# EAGLE design schemat (EAGLE 5.12)
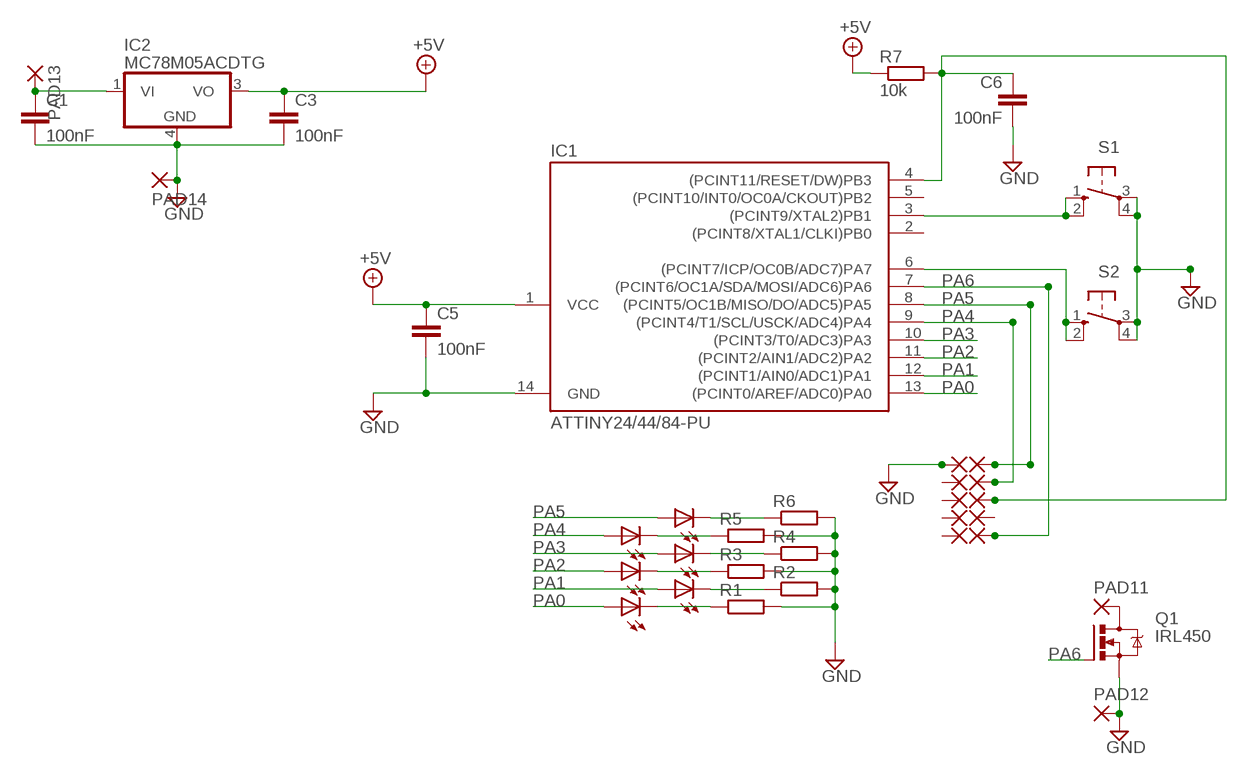
[diagram p0: schematic, sheet 1]

## Parts
C1  100nF  C-EU025-024X044  [C025-024X044]
C3  100nF  C-EU025-024X044  [C025-024X044]
C5  100nF  C-EU075-032X103  [C075-032X103]
C6  100nF  C-EU025-024X044  [C025-024X044]
IC1  ATTINY24/44/84-PU  [DIL14]
IC2  MC78M05ACDTG  [DPACK_3]
LED1  TLLG4400  [LED3MM]
LED2  TLLG4400  [LED3MM]
LED3  TLLY4400  [LED3MM]
LED4  TLLY4400  [LED3MM]
LED5  TLLR4400  [LED3MM]
LED6  TLLR4400  [LED3MM]
PAD1  1,6/0,8  [1,6/0,8]
PAD2  1,6/0,8  [1,6/0,8]
PAD3  1,6/0,8  [1,6/0,8]
PAD4  1,6/0,8  [1,6/0,8]
PAD5  1,6/0,8  [1,6/0,8]
PAD6  1,6/0,8  [1,6/0,8]
PAD7  1,6/0,8  [1,6/0,8]
PAD8  1,6/0,8  [1,6/0,8]
PAD9  1,6/0,8  [1,6/0,8]
PAD10  1,6/0,8  [1,6/0,8]
PAD11  3,81/1,4  [3,81/1,4]
PAD12  3,81/1,4  [3,81/1,4]
PAD13  2,15/1,0  [2,15/1,0]
PAD14  2,15/1,0  [2,15/1,0]
Q1  IRL450  IRLZ44Z  [TO220BH]
R1  R-EU_0204/7  [0204/7]
R2  R-EU_0204/7  [0204/7]
R3  R-EU_0204/7  [0204/7]
R4  R-EU_0204/7  [0204/7]
R5  R-EU_0204/7  [0204/7]
R6  R-EU_0204/7  [0204/7]
R7  10k  R-EU_0204/7  [0204/7]
S1  10-XX  [B3F-10XX]
S2  10-XX  [B3F-10XX]

## Nets
+5V: C3.1 C5.1 IC1.1(VCC) IC2.3(VO) R7.1
GND: C1.2 C3.2 C5.2 C6.2 IC1.14(GND) IC2.4(GND) PAD10.1(P) PAD12.1(P) PAD14.1(P) Q1.S R1.2 R2.2 R3.2 R4.2 R5.2 R6.2 S1.3(P) S1.4(P1) S2.3(P) S2.4(P1)
N$1: IC1.3((PCINT9/XTAL2)PB1) S1.1(S) S1.2(S1)
N$2: C1.1 IC2.1(VI) PAD13.1(P)
N$4: C6.1 IC1.4((PCINT11/RESET/DW)PB3) PAD3.1(P) R7.2
N$6: LED2.K(C) R2.1
N$7: LED1.K(C) R1.1
N$8: LED3.K(C) R3.1
N$9: LED4.K(C) R4.1
N$10: LED5.K(C) R5.1
N$11: LED6.K(C) R6.1
N$12: PAD11.1(P) Q1.D
N$17: IC1.6((PCINT7/ICP/OC0B/ADC7)PA7) S2.1(S) S2.2(S1)
PA0: IC1.13((PCINT0/AREF/ADC0)PA0) LED1.A
PA1: IC1.12((PCINT1/AIN0/ADC1)PA1) LED2.A
PA2: IC1.11((PCINT2/AIN1/ADC2)PA2) LED3.A
PA3: IC1.10((PCINT3/T0/ADC3)PA3) LED4.A
PA4: IC1.9((PCINT4/T1/SCL/USCK/ADC4)PA4) LED5.A PAD2.1(P)
PA5: IC1.8((PCINT5/OC1B/MISO/DO/ADC5)PA5) LED6.A PAD1.1(P)
PA6: IC1.7((PCINT6/OC1A/SDA/MOSI/ADC6)PA6) PAD5.1(P) Q1.G
Unconnected: IC1.2((PCINT8/XTAL1/CLKI)PB0) IC1.5((PCINT10/INT0/OC0A/CKOUT)PB2) PAD4.1(P) PAD6.1(P) PAD7.1(P) PAD8.1(P) PAD9.1(P)

## Library data of the parts
C1 C3 C5 C6 = rcl:C-EU: CAPACITOR, European symbol
IC1 = attiny24_44_84:ATTINY24/44/84
IC2 = linear:MC78M: 500 mA Positive Voltage Regulators Source: Data sheet <http://www.onsemi.com/pub_link/Collateral/MC78M00-D.PDF>
LED1 LED2 = led:TLLG4400: Low Current (2mA) LED 3 mm Tinted Diffused Package color GREEN Source: Data sheet <http://www.farnell.com/datasheets/391098.pdf>; MF: VISHAY SEMICONDUCTOR; OC_FARNELL: 1612435
LED3 LED4 = led:TLLY4400: Low Current (2mA) LED 3 mm Tinted Diffused Package color YELLOW Source: Data sheet <http://www.farnell.com/datasheets/391098.pdf>; MF: VISHAY SEMICONDUCTOR; OC_FARNELL: 1612439
LED5 LED6 = led:TLLR4400: Low Current (2mA) LED 3 mm Tinted Diffused Package color RED Source: Data sheet <http://www.farnell.com/datasheets/391100.pdf>; MF: VISHAY SEMICONDUCTOR; OC_FARNELL: 1612437
PAD1-PAD10 = wirepad:1,6/0,8: THROUGH-HOLE PAD
PAD11 PAD12 = wirepad:3,81/1,4: THROUGH-HOLE PAD
PAD13 PAD14 = wirepad:2,15/1,0: THROUGH-HOLE PAD
Q1 = transistor-power:IRLZ44Z: N-Channel HEXFET® Power MOSFET Logic Level AUTOMOTIVE MOSFET Source: http://www.irf.com/product-info/datasheets/data/irlz44zpbf.pdf
R1-R6 = resistor:R-EU_: RESISTOR, European symbol
R7 = rcl:R-EU_: RESISTOR, European symbol
S1 S2 = switch-omron:10-XX: OMRON SWITCH; MPN: B3F-1000; OC_FARNELL: 176432; OC_NEWARK: 36M3542

## Board
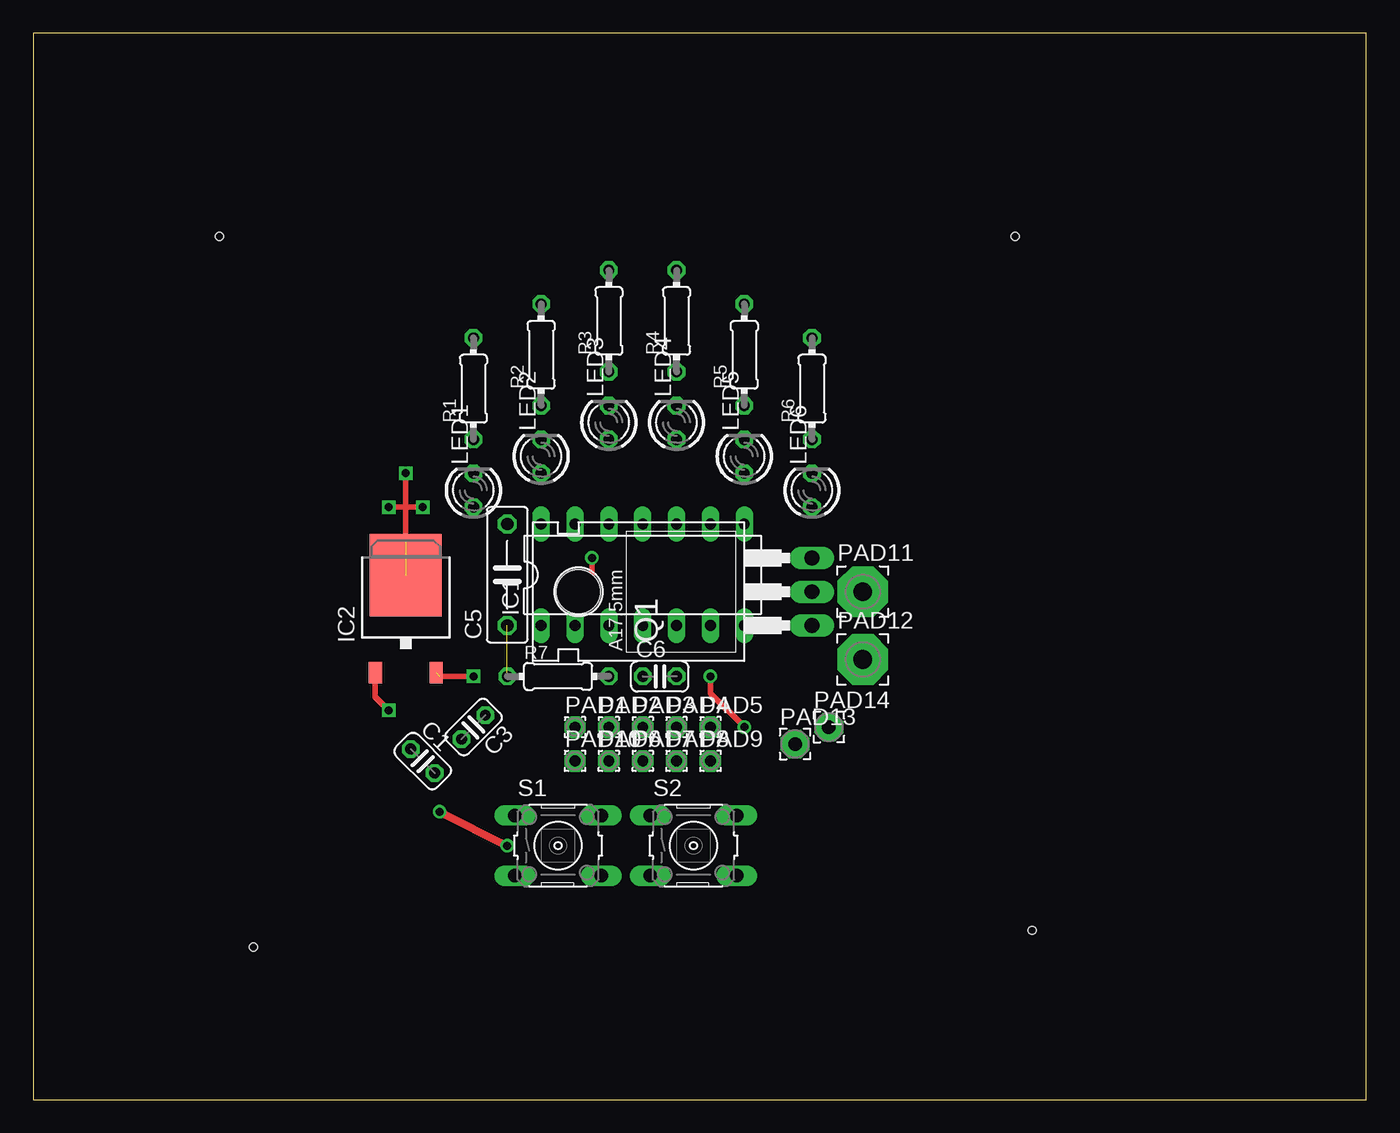
[diagram p1: board, top side]
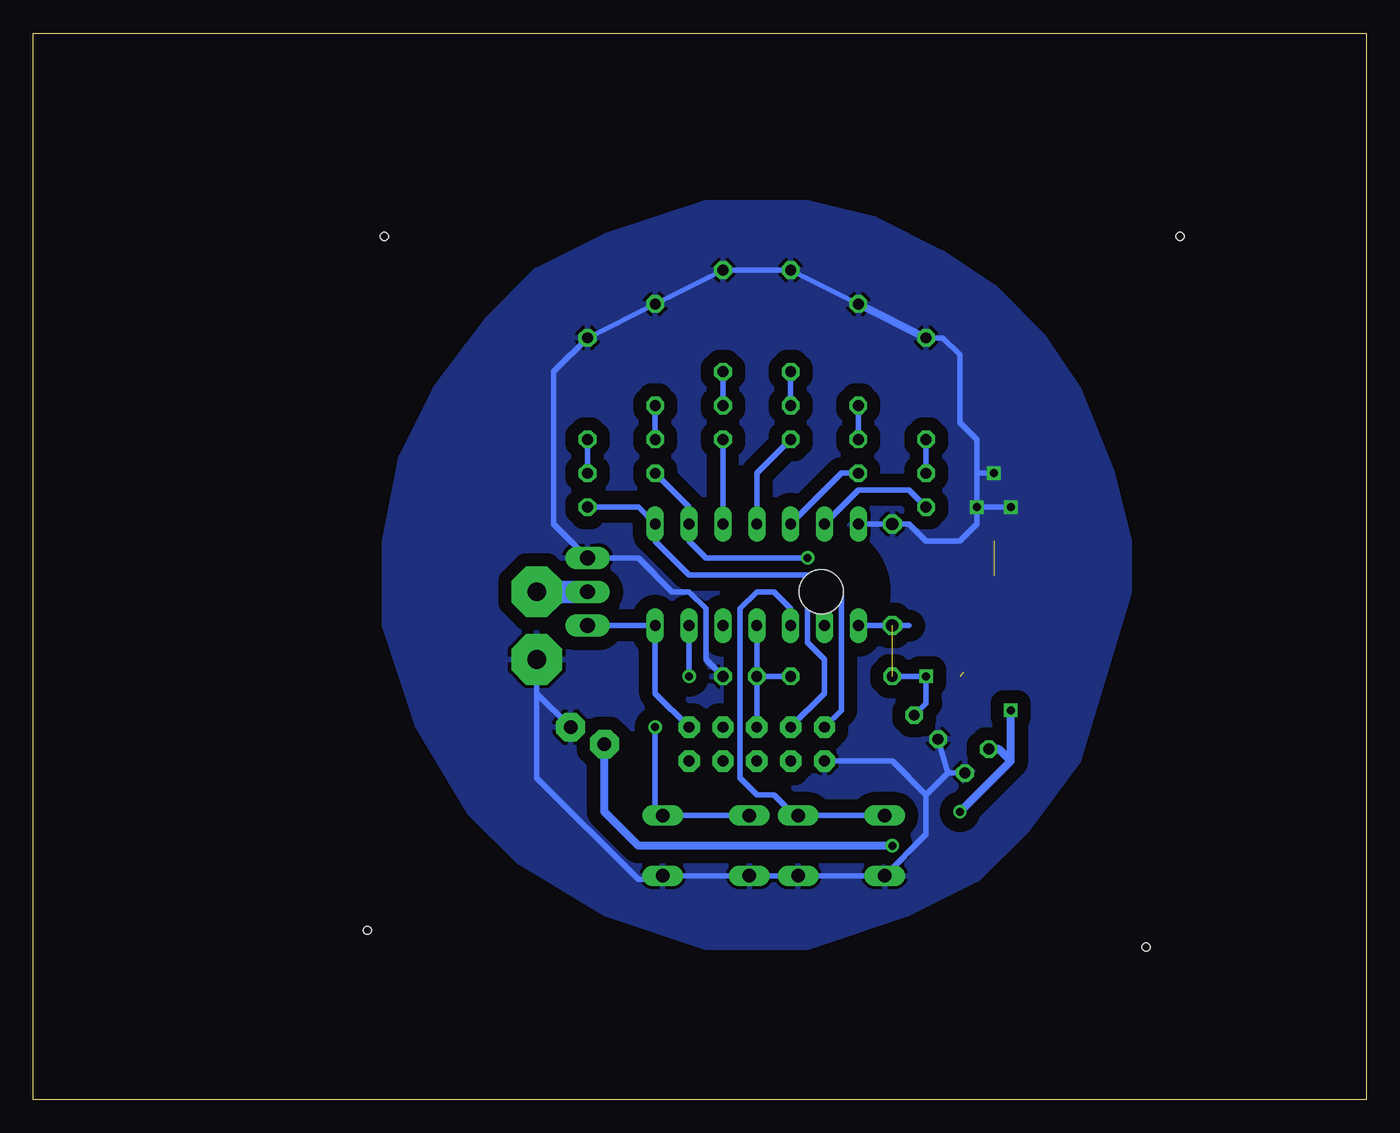
[diagram p2: board, bottom side, seen from below]

Size 100 x 80 mm. Coordinates in mm from the lower left corner, seen from the top.
Outline: 0,0 100,0 100,80 0,80 0,0
Copper layers (1*16): Top 0.035mm / dielectric 1.5mm / Bottom 0.035mm
Design rules "default": minimum track width 10mil, minimum drill 24mil, track to track 8mil, track to pad 8mil, pad to pad 8mil, via to via 8mil, smd to smd 8mil, copper to edge 40mil, drill to drill 8mil, minimum pad ring 10mil, minimum via ring 8mil, stop-mask expansion 4mil, vias tented up to drill 0mil, thermal gap 10mil
Holes 0.6 mm at 13.97,64.77 73.66,64.77 74.93,12.7 16.51,11.43

### Footprints (pad centres in the part's own frame; a part is rotated, then mirrored left to right if it is on the bottom)
C025-024X044 = drill 0.813 octagon: 1 -1.27,0; 2 1.27,0
C075-032X103 = drill 0.914 octagon: 1 -3.81,0; 2 3.81,0
DIL14 = drill 0.813 long: 1 -7.62,-3.81; 2 -5.08,-3.81; 3 -2.54,-3.81; 4 0,-3.81; 5 2.54,-3.81; 6 5.08,-3.81; 7 7.62,-3.81; 8 7.62,3.81; 9 5.08,3.81; 10 2.54,3.81; 11 0,3.81; 12 -2.54,3.81; 13 -5.08,3.81; 14 -7.62,3.81
DPACK_3 = smd 1 x 1.6: 1 -2.28,-4.8; 3 2.28,-4.8 | smd 5.4 x 6.2: 4 0,2.5
LED3MM = drill 0.813 octagon: A -1.27,0; K 1.27,0
1,6/0,8 = drill 0.813 pad 1.6 octagon: 1 0,0
3,81/1,4 = drill 1.397 pad 3.81 octagon: 1 0,0
2,15/1,0 = drill 1.016 pad 2.159 octagon: 1 0,0
TO220BH = drill 1.118 long: D 0,-6.35; G -2.54,-6.35; S 2.54,-6.35 | hole 3.302: 0,11.176
0204/7 = drill 0.813 octagon: 1 -3.81,0; 2 3.81,0
B3F-10XX = drill 1.016 long: 1 -3.251,2.261; 2 3.251,2.261; 3 -3.251,-2.261; 4 3.251,-2.261

### Placement (x,y rotation side)
C1  29.21,25.4 315 top
C3  33.02,27.94 225 top
C5  35.56,39.37 90 top
C6  46.99,31.75 0 top
IC1  45.72,39.37 0 top
IC2  27.94,36.83 0 top
LED1  33.02,45.72 90 top
LED2  38.1,48.26 90 top
LED3  43.18,50.8 90 top
LED4  48.26,50.8 90 top
LED5  53.34,48.26 90 top
LED6  58.42,45.72 90 top
PAD1  40.64,27.94 0 top
PAD2  43.18,27.94 0 top
PAD3  45.72,27.94 0 top
PAD4  48.26,27.94 0 top
PAD5  50.8,27.94 0 top
PAD6  43.18,25.4 0 top
PAD7  45.72,25.4 0 top
PAD8  48.26,25.4 0 top
PAD9  50.8,25.4 0 top
PAD10  40.64,25.4 0 top
PAD11  62.23,38.1 0 top
PAD12  62.23,33.02 0 top
PAD13  57.15,26.67 0 top
PAD14  59.69,27.94 0 top
Q1  52.07,38.1 90 top
R1  33.02,53.34 90 top
R2  38.1,55.88 90 top
R3  43.18,58.42 90 top
R4  48.26,58.42 90 top
R5  53.34,55.88 90 top
R6  58.42,53.34 90 top
R7  39.37,31.75 0 top
S1  39.37,19.05 0 top
S2  49.53,19.05 0 top

### Tracks (layer width: path | path; a pad name or v marks a point on that pad's centre or on a via)
+5V  (via drill 0.6)  (2 unrouted)
  Top 0.406: v33.02,31.75 30.48,31.75
  Bottom 0.406: 34.29,35.56 C5.1 IC1.1 | C3.1 33.02,29.74 v33.02,31.75 R7.1
GND  (via drill 0.6)  (1 unrouted)
  Top 0.406: 27.94,44.45 v29.21,44.45 | 27.94,44.45 27.94,41.91 | v26.67,44.45 27.94,44.45 | 27.94,44.45 v27.94,46.99
  Bottom 0.406: R2.2 R3.2 R4.2 R5.2 R6.2 60.96,54.61 60.96,43.18 Q1.S 54.61,40.64 52.07,38.1 50.8,38.1 49.53,36.83 49.53,33.02 C6.2 | IC1.14 C5.2 34.29,43.18 33.02,41.91 30.48,41.91 29.21,43.18 v29.21,44.45 | 33.02,22.86 33.02,19.89 S1.3 S1.4 S2.3 S2.4 | PAD10.1 35.56,25.4 33.02,22.86 | PAD14.1 62.23,30.48 PAD12.1 62.23,24.13 54.61,16.51 53.34,16.51 | 31.38,24.5 C1.2 | 33.02,22.86 31.38,24.5 | 31.38,24.5 C3.2 | R1.2 31.75,57.15 30.48,55.88 30.48,50.8 29.21,49.53 v29.21,44.45 | v26.67,44.45 v29.21,44.45 | v29.21,44.45 29.21,46.99 v27.94,46.99
  Bottom 0.61: R1.2 R2.2
  pour Bottom (isolate 1): 27.94,60.96 24.13,57.15 21.59,53.34 19.05,46.99 17.78,41.91 17.78,38.1 21.59,25.4 25.4,20.32 29.21,16.51 34.29,13.97 41.91,11.43 49.53,11.43 57.15,13.97 63.5,17.78 67.31,21.59 71.12,27.94 73.66,35.56 73.66,41.91 72.39,48.26 69.85,53.34 66.04,58.42 62.23,62.23 57.15,64.77 49.53,67.31 41.91,67.31 36.83,66.04 31.75,63.5
N$1
  Bottom 0.406: S1.1 S1.2 42.9,21.31 44.45,22.86 45.72,22.86 46.99,24.13 46.99,36.83 45.72,38.1 44.45,38.1 43.18,36.83 IC1.3
N$2  (via drill 0.6)
  Top 0.406: v26.67,29.21 25.66,30.22 IC2.1
  Top 0.61: v30.48,21.59 v35.56,19.05
  Bottom 0.61: v35.56,19.05 54.61,19.05 57.15,21.59 PAD13.1 | v30.48,21.59 27.94,24.13 26.67,25.4 | 26.67,25.4 v26.67,29.21 | 26.67,25.4 27.57,26.3 C1.1
N$4
  Bottom 0.406: C6.1 R7.2 | C6.1 IC1.4 | PAD3.1 C6.1
N$6
  Bottom 0.406: LED2.K R2.1
N$7
  Bottom 0.406: LED1.K R1.1
N$8
  Bottom 0.406: LED3.K R3.1
N$9
  Bottom 0.406: LED4.K R4.1
N$10
  Bottom 0.406: LED5.K R5.1
N$11
  Bottom 0.406: LED6.K R6.1
N$12
  Bottom 1.676: Q1.D PAD11.1
N$17  (via drill 0.6)
  Top 0.406: v50.8,31.75 50.8,30.48 v53.34,27.94
  Bottom 0.406: v50.8,31.75 IC1.6 | v53.34,27.94 53.34,21.87 S2.2 S2.1
PA0
  Bottom 0.406: LED1.A 34.29,45.72 38.1,45.72 IC1.13
PA1
  Bottom 0.406: IC1.12 39.37,46.99 LED2.A
PA2
  Bottom 0.406: IC1.11 45.72,46.99 LED3.A
PA3
  Bottom 0.406: IC1.10 LED4.A
PA4  (via drill 0.6)
  Top 0.406: v41.91,38.1 v41.91,40.64
  Bottom 0.406: LED5.A 50.8,44.45 IC1.9 50.8,41.91 49.53,40.64 v41.91,40.64 | PAD2.1 40.64,30.48 40.64,33.02 41.91,34.29 v41.91,38.1
PA5
  Bottom 0.406: LED6.A 54.61,44.45 IC1.8 53.34,41.91 50.8,39.37 40.64,39.37 39.37,38.1 39.37,29.21 PAD1.1
PA6
  Bottom 0.406: Q1.G IC1.7 53.34,30.48 PAD5.1